# EAGLE design ESP8266 (EAGLE 7.3.0)
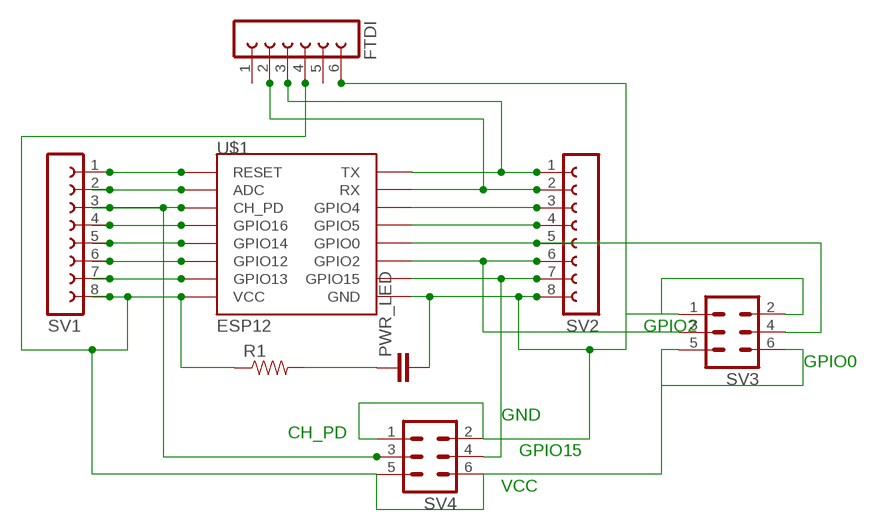
[diagram p0: schematic, sheet 1]

## Parts
FTDI  FE06-1  [FE06]
PWR_LED  CAP0805  [0805]
R1  RESISTOR0805-RES  [0805]
SV1  FE08-1  [FE08]
SV2  FE08-1  [FE08]
SV3  MA03-2  [MA03-2]
SV4  MA03-2  [MA03-2]
U$1  ESP12  [ESP12]

## Nets
GND: FTDI.6 PWR_LED.2 SV2.8 SV3.1 SV3.2 SV4.1 SV4.2 U$1.GND
N$1: SV1.3 SV4.3 U$1.CH_PD
N$2: SV1.1 U$1.RESET
N$3: SV1.6 U$1.GPIO12
N$4: SV1.5 U$1.GPIO14
N$5: SV1.4 U$1.GPIO16
N$6: SV1.7 U$1.GPIO13
N$7: SV1.2 U$1.ADC
N$8: FTDI.2 SV2.2 U$1.RX
N$9: SV2.3 U$1.GPIO4
N$10: SV2.4 U$1.GPIO5
N$11: SV2.5 SV3.4 U$1.GPIO0
N$12: SV2.6 SV3.3 U$1.GPIO2
N$13: SV2.7 SV4.4 U$1.GPIO15
N$14: FTDI.3 SV2.1 U$1.TX
N$15: PWR_LED.1 R1.2
VCC: FTDI.4 R1.1 SV1.8 SV3.5 SV3.6 SV4.5 SV4.6 U$1.VCC
Unconnected: FTDI.1 FTDI.5

## Notes on the sheet
- GPIO2
- GPIO0
- GND
- CH_PD
- GPIO15
- VCC

## Library data of the parts
FTDI = con-lsta:FE06-1: FEMALE HEADER; OC_FARNELL: unknown; OC_NEWARK: unknown
PWR_LED = SparkFun-Passives:CAP: Capacitor Standard 0603 ceramic capacitor, and 0.1" leaded capacitor.
R1 = SparkFun-Passives:RESISTOR: Resistor Basic schematic elements and footprints for 0603, 1206, and PTH resistors.
SV1 SV2 = con-lsta:FE08-1: FEMALE HEADER; OC_FARNELL: unknown; OC_NEWARK: unknown
SV3 SV4 = con-lstb:MA03-2: PIN HEADER; OC_FARNELL: unknown; OC_NEWARK: unknown
U$1 = esp8266modules:ESP12: ESP8266 Wifi module 12

## Board
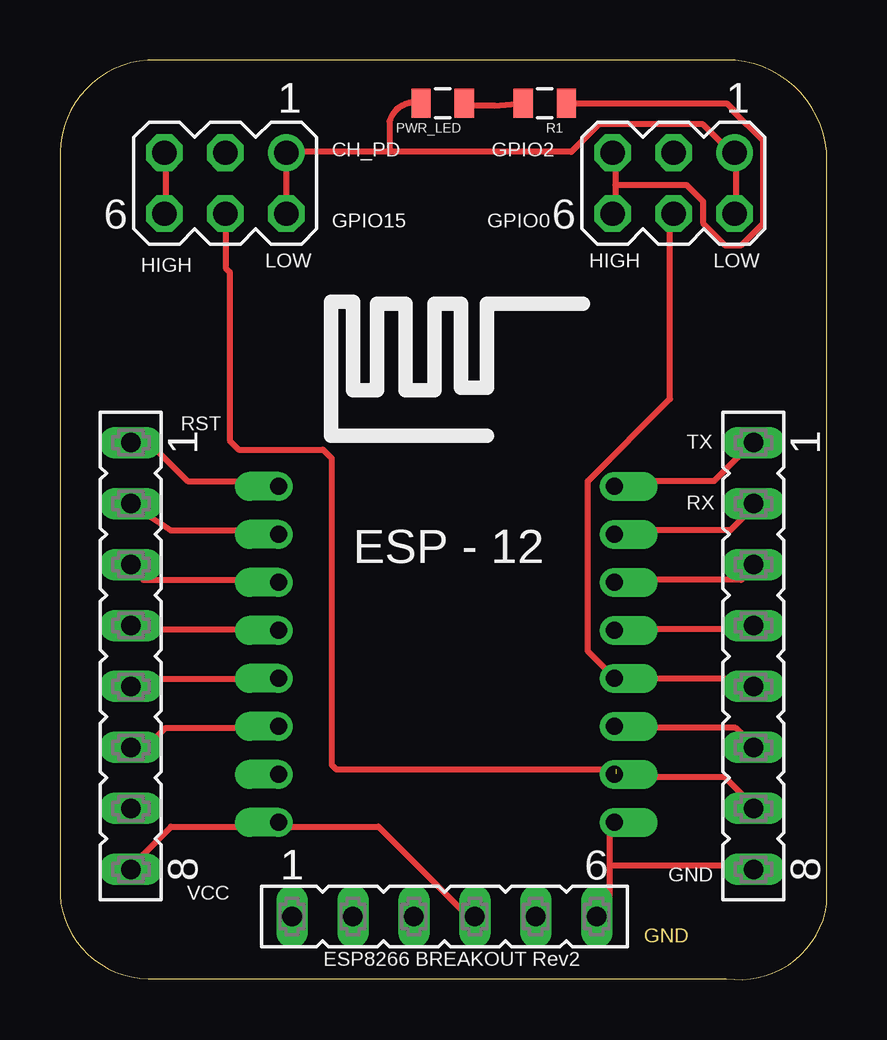
[diagram p1: board, top side]
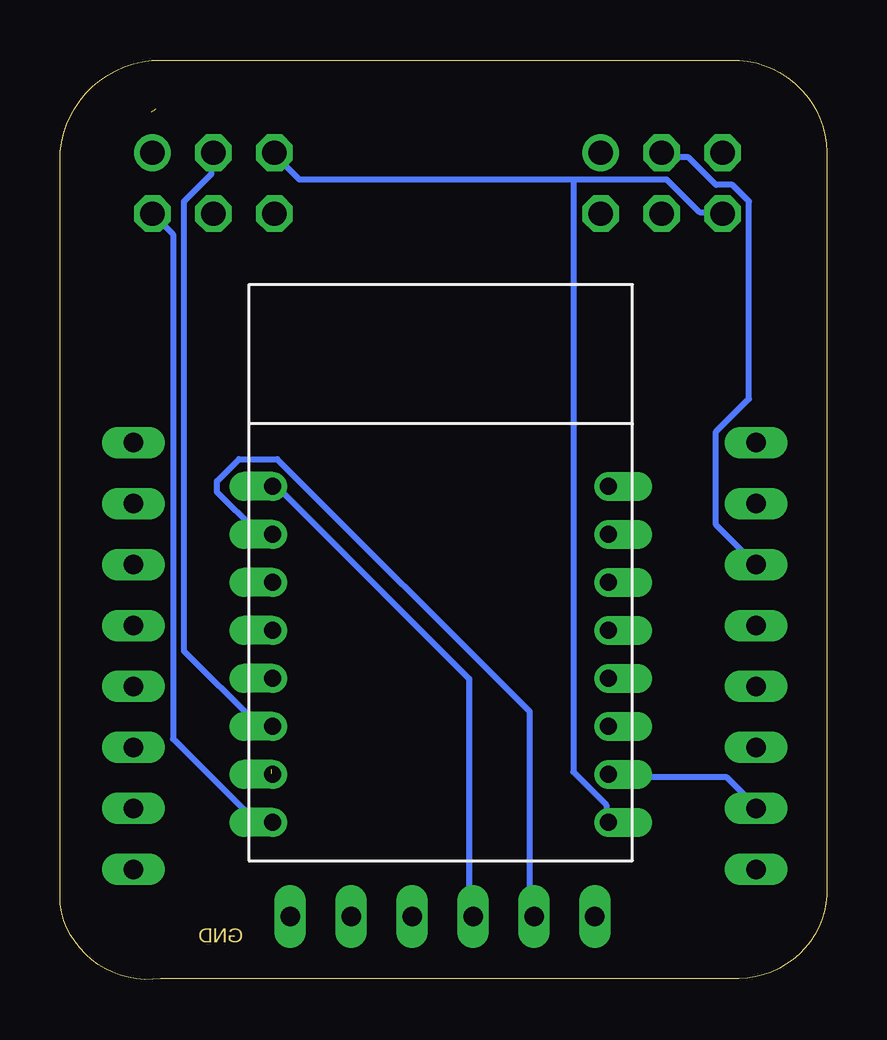
[diagram p2: board, bottom side, seen from below]

Size 31.98 x 38.31 mm. Coordinates in mm from the lower left corner, seen from the top.
Outline: 0,34.48 0,3.5 arc90 4.02,0.04 27.77,0.04 arc90 31.98,3.13 31.98,34.11 arc90 27.77,38.31 4.02,38.31 arc90 0,34.48
Copper layers (1*16): Top 0.035mm / dielectric 1.5mm / Bottom 0.035mm
Design rules "default": minimum track width 10mil, minimum drill 24mil, track to track 8mil, track to pad 8mil, pad to pad 8mil, via to via 8mil, smd to smd 8mil, copper to edge 40mil, drill to drill 8mil, minimum pad ring 10mil, minimum via ring 8mil, stop-mask expansion 4mil, vias tented up to drill 0mil, thermal gap 10mil

### Footprints (pad centres in the part's own frame; a part is rotated, then mirrored left to right if it is on the bottom)
FE06 = drill 0.813 long: 1 -6.35,0; 2 -3.81,0; 3 -1.27,0; 4 1.27,0; 5 3.81,0; 6 6.35,0
0805 = smd 0.8 x 1.2: 1 -0.9,0; 2 0.9,0
FE08 = drill 0.813 long: 1 -8.89,0; 2 -6.35,0; 3 -3.81,0; 4 -1.27,0; 5 1.27,0; 6 3.81,0; 7 6.35,0; 8 8.89,0
MA03-2 = drill 1.016: 1 -2.54,-1.27 | drill 1.016 octagon: 2 -2.54,1.27; 3 0,-1.27; 4 0,1.27; 5 2.54,-1.27; 6 2.54,1.27
ESP12 = drill 0.7 offset: ADC -7.1,3.8; CH_PD -7.1,1.8; GND 6.9,-8.2; GPIO0 6.9,-2.2; GPIO2 6.9,-4.2; GPIO4 6.9,1.8; GPIO5 6.9,-0.2; GPIO12 -7.1,-4.2; GPIO13 -7.1,-6.2; GPIO14 -7.1,-2.2; GPIO15 6.9,-6.2; GPIO16 -7.1,-0.2; RESET -7.1,5.8; RX 6.9,3.8; TX 6.9,5.8; VCC -7.1,-8.2

### Placement (x,y rotation side)
FTDI  16.03,2.63 0 top
PWR_LED  15.96,36.51 180 top
R1  20.21,36.51 180 top
SV1  2.96,13.48 270 top
SV2  28.91,13.48 270 top
SV3  25.58,33.18 180 top
SV4  6.89,33.18 180 top
U$1  16.21,14.75 0 top

### Tracks (layer width: path | path; a pad name or v marks a point on that pad's centre or on a via)
GND
  Top 0.254: 22.92,4.77 22.92,3.17 FTDI.6 | 22.92,4.77 22.92,6.37 U$1.GND | 22.92,4.77 28.86,4.77 SV2.8 | SV4.2 9.43,31.97 9.43,34.26 SV4.1 9.66,34.49 13.74,34.49 | SV3.2 28.18,31.97 28.18,34.26 SV3.1 27.95,34.49 26.8,35.63 22.46,35.63 21.32,34.49 13.74,34.49 | PWR_LED.2 arc90 13.74,35.74 13.74,34.49
  Bottom 0.254: U$1.GND 23.15,6.6 23.83,6.6 27.26,10.03 27.26,31.06 27.95,31.74 SV3.2
N$1
  Top 0.254: U$1.CH_PD 8.97,16.65 3.49,16.65 3.03,17.11 SV1.3
  Bottom 0.254: SV4.3 6.69,34.26 5.77,34.26 4.63,33.11 3.94,33.11 3.26,32.43 3.26,24.2 4.63,22.83 4.63,18.94 3.03,17.34 SV1.3
N$2
  Top 0.254: U$1.RESET 8.97,20.77 5.31,20.77 3.71,22.37 SV1.1
N$3
  Top 0.254: U$1.GPIO12 8.97,10.48 4.4,10.48 3.71,9.8 SV1.6
N$4
  Top 0.254: U$1.GPIO14 8.97,12.54 3.94,12.54 3.71,12.31 SV1.5
N$5
  Top 0.254: U$1.GPIO16 8.97,14.6 3.71,14.6 SV1.4
N$6
  Bottom 0.254: U$1.GPIO13 8.97,8.42 4.17,8.42 3.03,7.28 SV1.7
N$7
  Top 0.254: SV1.2 4.63,18.71 8.97,18.71 U$1.ADC
N$8
  Top 0.254: U$1.RX 23.15,18.71 27.95,18.71 28.86,19.63 SV2.2
  Bottom 0.254: FTDI.2 12.4,2.71 12.4,11.17 22.92,21.68 24.52,21.68 25.43,20.77 25.43,20.31 23.83,18.71 23.15,18.71 U$1.RX
N$9
  Top 0.254: U$1.GPIO4 23.15,16.65 28.4,16.65 28.86,17.11 SV2.3
N$10
  Top 0.254: U$1.GPIO5 23.15,14.6 28.86,14.6 SV2.4
N$11
  Top 0.254: SV2.5 28.86,12.31 28.63,12.54 23.15,12.54 U$1.GPIO0 22.92,12.77 22,13.68 22,20.77 25.43,24.2 25.43,31.74 SV3.4
N$12
  Top 0.254: U$1.GPIO2 23.15,10.48 28.18,10.48 28.86,9.8 SV2.6
  Bottom 0.254: SV3.3 25.66,34.26 25.66,33.57 26.8,32.43 26.8,13.68 23.83,10.71 23.15,10.71 U$1.GPIO2
N$13  (1 unrouted)
  Top 0.254: SV2.7 28.86,7.28 27.72,8.42 23.15,8.42 U$1.GPIO15 23.15,8.55 arc90 23.17,8.57 22.99,8.57 | SV4.4 6.92,31.74 6.92,29.64 7.08,29.48 7.08,22.45 7.45,22.08 10.96,22.08 11.33,21.71 11.33,8.94 11.52,8.76 23.17,8.76 23.36,8.57
N$14
  Top 0.254: U$1.TX 23.15,20.77 27.26,20.77 28.86,22.37 SV2.1
  Bottom 0.254: FTDI.3 14.92,2.71 14.92,12.54 22.92,20.54 U$1.TX
N$15
  Top 0.254: PWR_LED.1 16.97,36.41 18.12,36.41 R1.2
VCC  (1 unrouted)
  Top 0.254: SV1.8 3.03,4.77 4.63,6.37 8.97,6.37 U$1.VCC 9.2,6.37 13.27,6.37 16.93,2.71 17.2,2.71 FTDI.4 | SV4.6 4.4,31.97 4.4,34.26 SV4.5 | 23.15,33.11 23.15,34.26 SV3.5 | 23.15,33.11 23.15,31.97 SV3.6 | 27.99,36.27 29.32,34.94 29.32,31.51 28.4,30.6 27.72,30.6 26.8,31.51 26.8,32.43 26.12,33.11 23.15,33.11 | R1.1 21.14,36.51 | 21.32,36.32 21.14,36.51 | 21.14,36.51 27.8,36.51 28.17,36.14
  Bottom 0.254: 10.57,33.34 22,33.34 22.92,34.26 SV3.5 | 10.57,33.34 6.69,33.34 5.31,31.97 4.4,31.97 SV4.6 | 10.57,33.34 10.57,8.65 9.2,7.28 9.2,6.6 U$1.VCC

### Text on the board
Dimension: GND
tPlace: CH_PD | GPIO2 | GPIO15 | GPIO0 | HIGH | LOW | HIGH | LOW | RST | TX | RX | GND | VCC | ESP8266 BREAKOUT Rev2